# EAGLE design proiect (EAGLE 9.6.0)
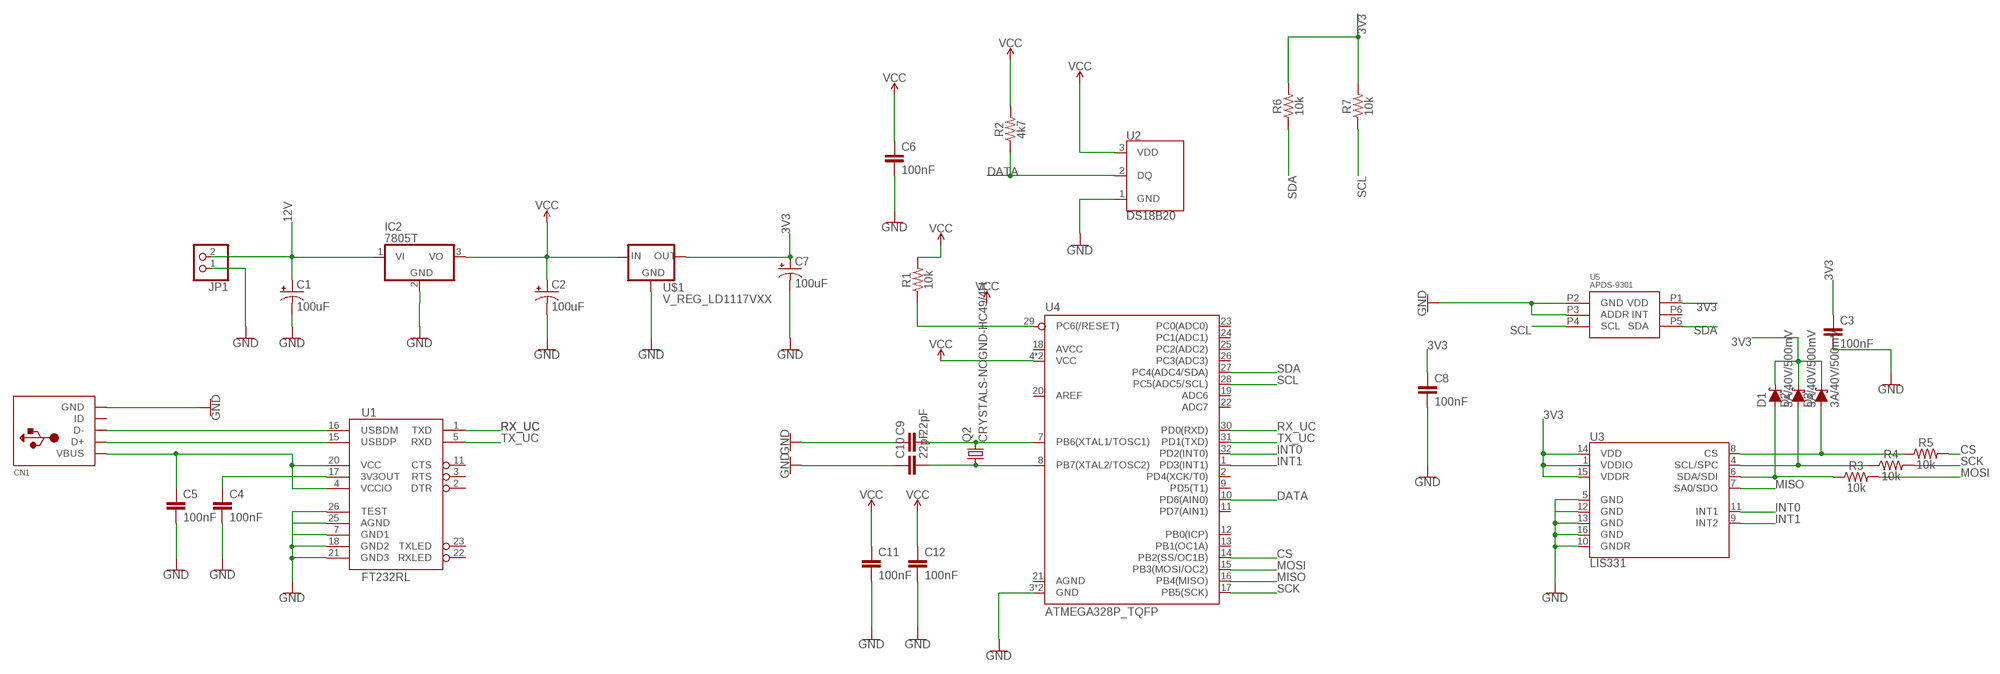
[diagram p0: schematic, sheet 1]

## Parts
C1  100uF  100UF-POLAR-RADIAL-2.5MM-25V-20%  [CPOL-RADIAL-2.5MM-6.5MM]
C2  100uF  100UF-POLAR-RADIAL-2.5MM-25V-20%  [CPOL-RADIAL-2.5MM-6.5MM]
C3  100nF  0.1UF-0603-25V-(+80/-20%)  [0603]
C4  100nF  0.1UF-0603-25V-(+80/-20%)  [0603]
C5  100nF  0.1UF-0603-25V-(+80/-20%)  [0603]
C6  100nF  0.1UF-0603-25V-(+80/-20%)  [0603]
C7  100uF  100UF-POLAR-RADIAL-2.5MM-25V-20%  [CPOL-RADIAL-2.5MM-6.5MM]
C8  100nF  0.1UF-0603-25V-(+80/-20%)  [0603]
C9  22pF  0.1UF-0603-25V-(+80/-20%)  [0603]
C10  22pF  0.1UF-0603-25V-(+80/-20%)  [0603]
C11  100nF  0.1UF-0603-25V-(+80/-20%)  [0603]
C12  100nF  0.1UF-0603-25V-(+80/-20%)  [0603]
CN1  USBMINIB  [USB-MINIB]
D1  3A/40V/500mV  DIODE-SCHOTTKY-B340A  [SMA-DIODE]
D2  3A/40V/500mV  DIODE-SCHOTTKY-B340A  [SMA-DIODE]
D3  3A/40V/500mV  DIODE-SCHOTTKY-B340A  [SMA-DIODE]
IC2  7805T  [TO220H]
JP1  PINHD-1X2  [1X02]
Q2  CRYSTALS-NOGND-HC49/4H  [HC49]
R1  10k  1KOHM-0603-1/10W-1%  [0603]
R2  4k7  1KOHM-0603-1/10W-1%  [0603]
R3  10k  1KOHM-0603-1/10W-1%  [0603]
R4  10k  1KOHM-0603-1/10W-1%  [0603]
R5  10k  1KOHM-0603-1/10W-1%  [0603]
R6  10k  1KOHM-0603-1/10W-1%  [0603]
R7  10k  1KOHM-0603-1/10W-1%  [0603]
U1  FT232RL  FT232RL-BASICSSOP  [SSOP28DB]
U2  DS18B20  [TO-92-AMMO]
U3  LIS331  [LGA-16-3X3]
U4  ATMEGA328P_TQFP  [TQFP32-08]
U5  APDS-9301  [CHIPLED-6]
U$1  V_REG_LD1117VXX  [78XXL]

## Nets
3V3: C3.1 C7.1(+) C8.1 D1.C D2.C D3.C R6.2 R7.2 U3.1(VDDIO) U3.14(VDD) U3.15(VDDR) U5.P1(VDD) U$1.GND(OUT)
12V: C1.1(+) IC2.1(VI) JP1.2
CS: R5.2 U4.14(PB2(SS/OC1B))
DATA: R2.1 U2.2(DQ) U4.10(PD6(AIN0))
GND: C1.2(-) C2.2(-) C3.2 C4.2 C5.2 C6.2 C7.2(-) C8.2 C9.1 C10.1 C11.2 C12.2 CN1.GND IC2.2(GND) JP1.1 U1.7(GND1) U1.18(GND2) U1.21(GND3) U1.25(AGND) U1.26(TEST) U2.1(GND) U3.5(GND) U3.10(GNDR) U3.12(GND) U3.13(GND) U3.16(GND) U4.3(GND) U4.5(GND) U5.P2(GND) U5.P3(ADDR) U$1.IN(GND)
INT0: U3.11(INT1) U4.32(PD2(INT0))
INT1: U3.9(INT2) U4.1(PD3(INT1))
MISO: U3.7(SA0/SDO) U4.16(PB4(MISO))
MOSI: R3.2 U4.15(PB3(MOSI/OC2))
N$1: CN1.D- U1.16(USBDM)
N$2: CN1.D+ U1.15(USBDP)
N$3: C5.1 CN1.VBUS U1.4(VCCIO) U1.20(VCC)
N$4: C4.1 U1.17(3V3OUT)
N$8: C9.2 Q2.2 U4.7(PB6(XTAL1/TOSC1))
N$9: C10.2 Q2.1 U4.8(PB7(XTAL2/TOSC2))
N$10: R1.1 U4.29(PC6(/RESET))
N$27: D1.A R3.1 U3.6(SDA/SDI)
N$28: D2.A R4.1 U3.4(SCL/SPC)
N$29: D3.A R5.1 U3.8(CS)
RX_UC: U1.1(TXD) U4.30(PD0(RXD))
SCK: R4.2 U4.17(PB5(SCK))
SCL: R7.1 U4.28(PC5(ADC5/SCL)) U5.P4(SCL)
SDA: R6.1 U4.27(PC4(ADC4/SDA)) U5.P5(SDA)
TX_UC: U1.5(RXD) U4.31(PD1(TXD))
VCC: C2.1(+) C6.1 C11.1 C12.1 IC2.3(VO) R1.2 R2.2 U2.3(VDD) U4.4(VCC) U4.6(VCC) U$1.OUT(IN)
Unconnected: CN1.ID U1.2(DTR) U1.3(RTS) U1.11(CTS) U1.22(RXLED) U1.23(TXLED) U4.2(PD4(XCK/T0)) U4.9(PD5(T1)) U4.11(PD7(AIN1)) U4.12(PB0(ICP)) U4.13(PB1(OC1A)) U4.18(AVCC) U4.19(ADC6) U4.20(AREF) U4.21(AGND) U4.22(ADC7) U4.23(PC0(ADC0)) U4.24(PC1(ADC1)) U4.25(PC2(ADC2)) U4.26(PC3(ADC3)) U5.P6(INT)

## Library data of the parts
C1 C2 C7 = SparkFun-Capacitors:100UF-POLAR: 100µF polarized capacitors A capacitor is a passive two-terminal electrical component used to store electrical energy temporarily in an electric field.; PROD_ID: CAP-08439
C3-C6 C8-C12 = SparkFun-Capacitors:0.1UF: 0.1µF ceramic capacitors A capacitor is a passive two-terminal electrical component used to store electrical energy temporarily in an electric field.; PROD_ID: CAP-00810; VALUE: 0.1uF
CN1 = adafruit:USB: USB Connectors USBMINIB - Surface Mount Female Mini-B USB Connector 4UConnector: 06564 By microbuilder.eu Thru-hole RA Female Mini-B USB Connector 4UConnector: 18732 By ladyada.net
D1-D3 = SparkFun-DiscreteSemi:DIODE-SCHOTTKY: Schottky diode A Schottky diode is a semiconductor diode which has a low forward voltage drop and a very fast switching action.; PROD_ID: DIO-09886
IC2 = adafruit:78*: Positive VOLTAGE REGULATOR Added bigger pads to the TO-92 package
JP1 = pinhead:PINHD-1X2: PIN HEADER
Q2 = IQD-Frequency-Products:CRYSTALS-NOGND: CRYSTALS CAN NOT GROUNDED
R1-R7 = SparkFun-Resistors:1KOHM: 1kΩ resistor A resistor is a passive two-terminal electrical component that implements electrical resistance as a circuit element. Resistors act to reduce current flow, and, at the same time, act to lower voltage levels within circuits. - Wikipedia; PROD_ID: RES-07856; VALUE: 1k
U1 = SparkFun-IC-Comms:FT232RL-BASIC: FT232RL USB UART This is the simplified version of the FT232RL unit. Only what you need, nothing you don't. FT232RL 4th Generation USB UART (USB <-> Serial) Controller. Datasheet <http://www.sparkfun.com/datasheets/IC/FT232R_v104.pdf> SparkFun Products Component <https://www.sparkfun.com/products/650> (COM-00650) SparkFun RedBot Mainboard <https://www.sparkfun.com/products/12097> (ROB-12097) SparkFun FTDI Basic Breakout - 5V <https://www.sparkfun.com/products/9716> (DEV-09716) SparkFun FTDI Basic Breakout - 3.3V <https://www.sparkfun.com/products/9873> (DEV-09873) Bus Pirate - v3.6a <https://www.sparkfun.com/products/12942> (TOL-12942) SparkFun USB to Serial Breakout - FT232RL <https://www.sparkfun.com/products/12731> (BOB-12731) SparkFun PicoBoard <https://www.sparkfun.com/products/11888> (WIG-11888) SparkFun RFID USB Reader <https://www.sparkfun.com/products/9963> (SEN-09963) LilyPad FTDI Basic Breakout - 5V <https://www.sparkfun.com/products/10275> (DEV-10275) SparkFun Stepoko <https://www.sparkfun.com/products/13899> (ROB-13899); PROD_ID: IC-00870
U2 = SparkFun-Sensors:DS18B20: Dallas/Maxim DS18B20 1-Wire Temperature Sensor The DS18B20 reports degrees C with 9 to 12-bit precision, -55C to 125C (+/-0.5C). Each sensor has a unique 64-Bit Serial number etched into it - allows for a huge number of sensors to be used on one data bus. Datasheet <http://datasheets.maximintegrated.com/en/ds/DS18B20.pdf> SparkFun Products One Wire Digital Temperature Sensor - DS18B20 <https://www.sparkfun.com/products/245> (SEN-00245); STORE_ID: SEN-00245
U3 = SparkFun-Sensors:LIS331: ST Microelectronics LIS331 3-Axis ±6/12/24g SPI/I2C Accelerometer The LIS331HH is an ultra low-power full-scale three axis MEMS linear accelerometer. It has a digital I2C/SPI serial interface which makes it ideal for using in embedded applications. The device also features ultra low-power operational modes that allow advanced power saving and smart sleep to wake-up functions. Datasheet <http://www.sparkfun.com/datasheets/Sensors/Accelerometer/LIS331HH.pdf> SparkFun Products SparkFun Triple Axis Accelerometer Breakout - LIS331 <https://www.sparkfun.com/products/10345> (SEN-10345) Triple Axis Accelerometer - LIS331HH <https://www.sparkfun.com/products/9755> (SEN-09755); PROD_ID: IC-12675; SF_ID: COM-09755
U4 = SparkFun-IC-Microcontroller:ATMEGA328P_TQFP: Popular 328P in QFP Storefront component: ATmega328 - TQFP <https://www.sparkfun.com/products/13448> (COM-13448) Datasheet <http://www.sparkfun.com/datasheets/Components/SMD/ATMega328.pdf> SparkFun Products SparkFun RedBoard - Programmed with Arduino <https://www.sparkfun.com/products/12757> (DEV-12757) Arduino Pro Mini 328 - 5V/16MHz <https://www.sparkfun.com/products/11113> (DEV-11113) Arduino Pro Mini 328 - 3.3V/8MHz <https://www.sparkfun.com/products/11114> (DEV-11114) SparkFun OpenLog <https://www.sparkfun.com/products/13712> (DEV-13712) SparkFun MicroView - OLED Arduino Module <https://www.sparkfun.com/products/12923> (DEV-12923) SparkFun Digital Sandbox <https://www.sparkfun.com/products/12651> (DEV-12651) SparkFun PicoBoard <https://www.sparkfun.com/products/11888> (WIG-11888) Arduino Fio <https://www.sparkfun.com/products/10116> (DEV-10116) LilyPad Arduino 328 Main Board <https://www.sparkfun.com/products/13342> (DEV-13342) SparkFun RedStick <https://www.sparkfun.com/products/13741> (DEV-13741) LilyPad MP3 <https://www.sparkfun.com/products/11013> (DEV-11013) LilyPad Arduino SimpleSnap <https://www.sparkfun.com/products/10941> (DEV-10941) SparkFun Stepoko <https://www.sparkfun.com/products/13899> (ROB-13899) SparkFun Geiger Counter <https://www.sparkfun.com/products/11345> (SEN-11345) SparkFun EL Sequencer <https://www.sparkfun.com/products/12781> (COM-12781) Arduino Pro 328 - 5V/16MHz <https://www.sparkfun.com/products/10915> (DEV-10915) CryptoCape <https://www.sparkfun.com/products/12773> (DEV-12773) SparkFun IR Thermometer Evaluation Board - MLX90614 <https://www.sparkfun.com/products/10740> (SEN-10740) SparkFun RedBot Mainboard <https://www.sparkfun.com/products/12097> (ROB-12097) Arduino Pro 328 - 3.3V/8MHz <https://www.sparkfun.com/products/10914> (DEV-10914) SparkFun Block for Intel® Edison - Arduino <https://www.sparkfun.com/products/13036> (DEV-13036) SparkFun Simon Says - Surface Mount Soldering Kit <https://www.sparkfun.com/products/10935> (KIT-10935) SparkFun 7-Segment Serial Display - Red <https://www.sparkfun.com/products/11441> (COM-11441) SparkFun 7-Segment Serial Display - White <https://www.sparkfun.com/products/11629> (COM-11629) SparkFun 7-Segment Serial Display - Yellow <https://www.sparkfun.com/products/11443> (COM-11443) SparkFun 7-Segment Serial Display - Kelly Green <https://www.sparkfun.com/products/11440> (COM-11440) SparkFun 7-Segment Serial Display - Blue <https://www.sparkfun.com/products/11442> (COM-11442) SparkFun OpenSegment Serial Display - 20mm (Blue) <https://www.sparkfun.com/products/11647> (COM-11647) SparkFun OpenSegment Serial Display - 20mm (Green) <https://www.sparkfun.com/products/11646> (COM-11646) SparkFun OpenSegment Serial Display - 20mm (White) <https://www.sparkfun.com/products/11648> (COM-11648) SparkFun OpenSegment Serial Display - 20mm (Red) <https://www.sparkfun.com/products/11644> (COM-11644) SparkFun OpenSegment Serial Display - 20mm (Yellow) <https://www.sparkfun.com/products/11645> (COM-11645) SparkFun OpenSegment Shield <https://www.sparkfun.com/products/13190> (DEV-13190); PROD_ID: IC-09069
U5 = SparkFun-Sensors:APDS-9301; PROD_ID: IC-13662
U$1 = SparkFun-IC-Power:V_REG_LD1117VXX: LD1117VXX voltage regulator. We carry the 3.3V version (COM-00526) in TO-220 package.

## Board
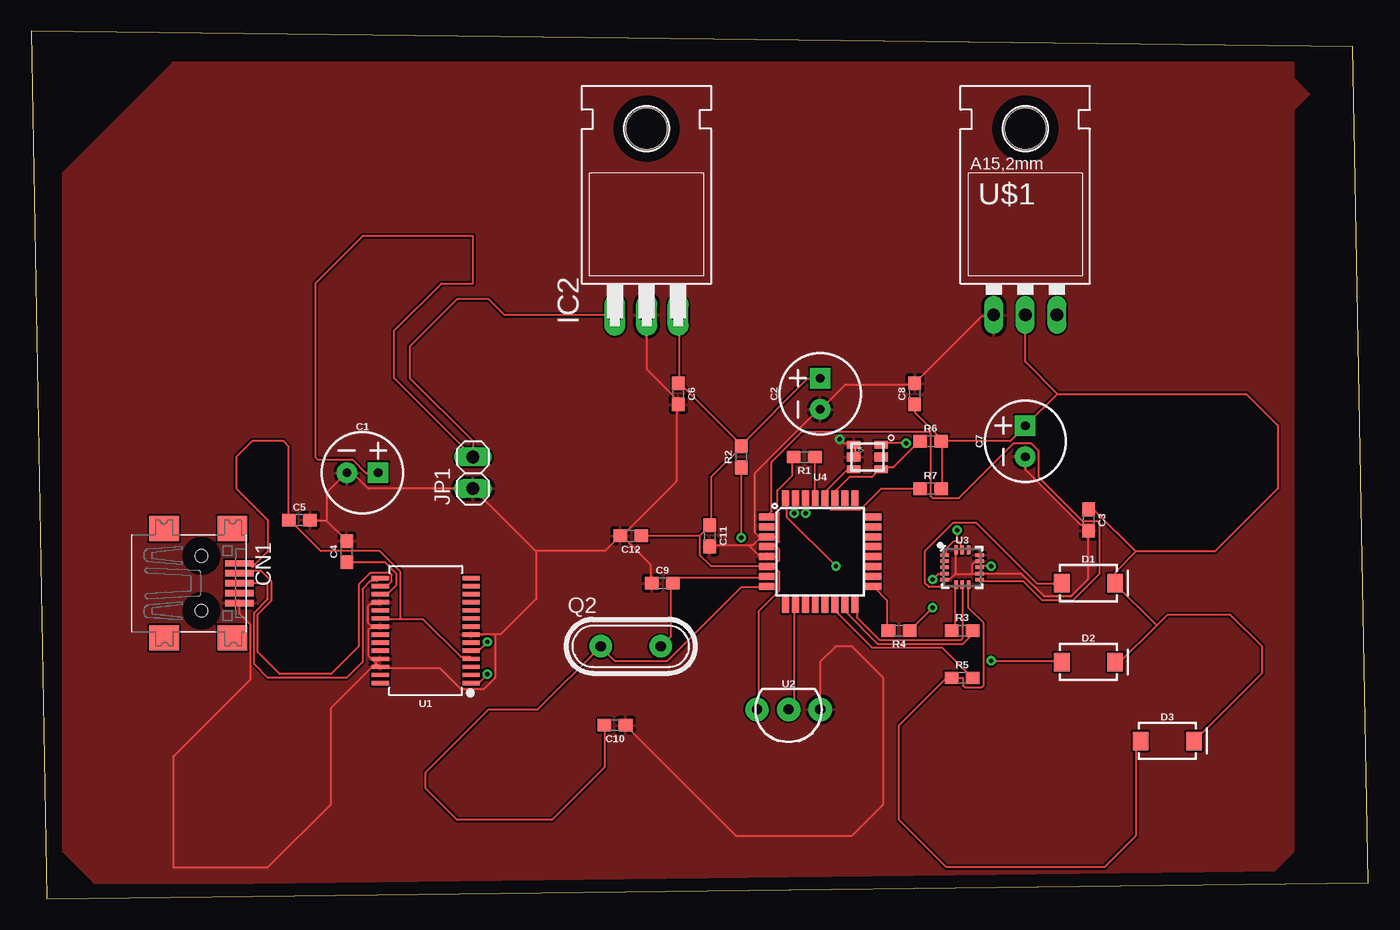
[diagram p1: board, top side]
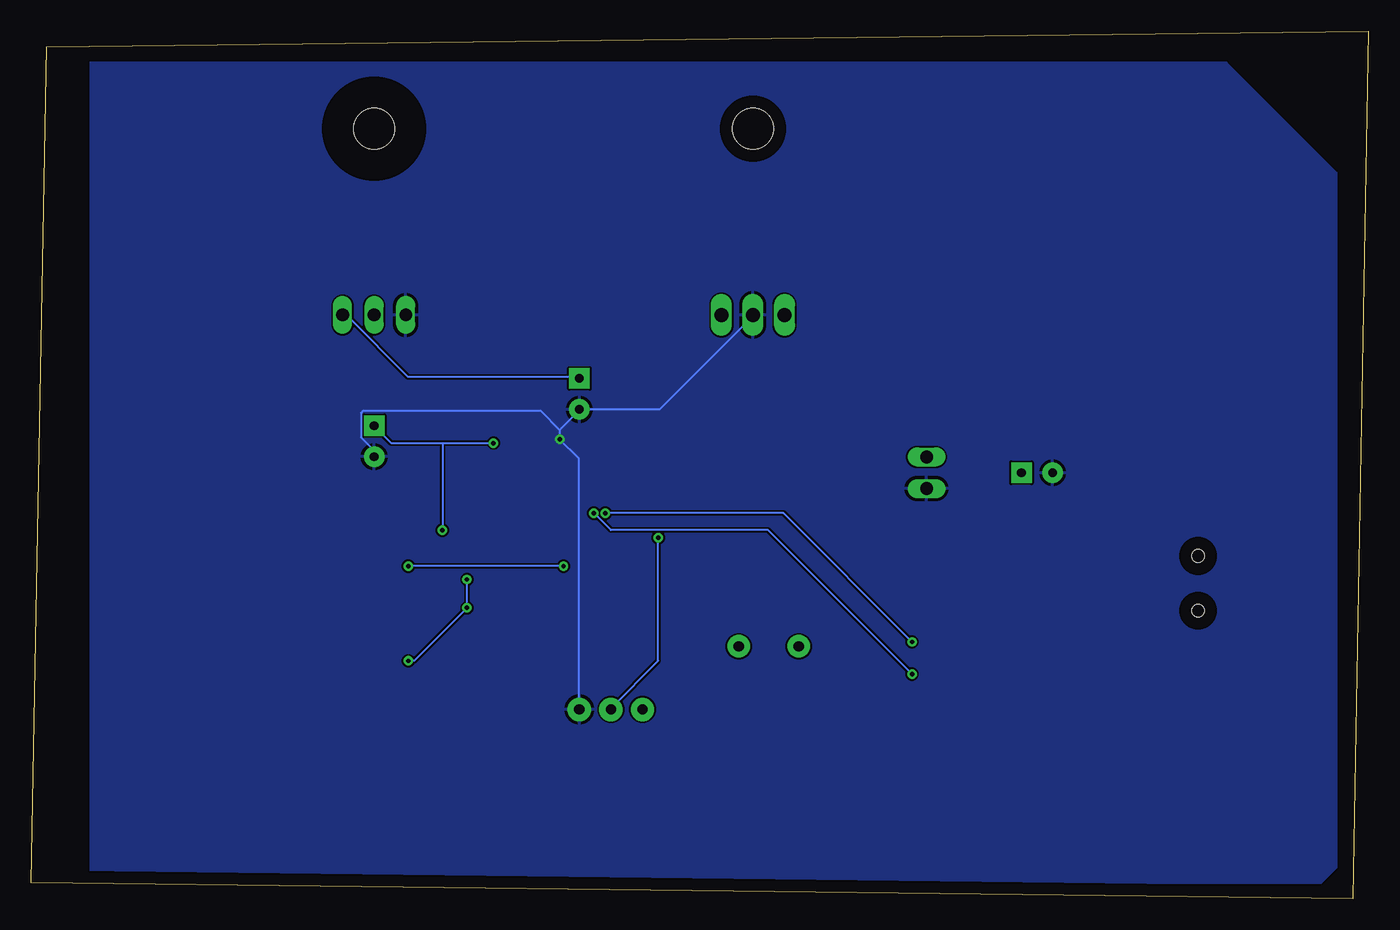
[diagram p2: board, bottom side, seen from below]

Size 107.62 x 69.84 mm. Coordinates in mm from the lower left corner, seen from the top.
Outline: 1.27,0 107.62,1.27 106.35,68.57 0,69.84 1.27,0
Copper layers (1*16): Top 0.035mm / dielectric 1.5mm / Bottom 0.035mm
Design rules "default": minimum track width 6mil, minimum drill 0.35mm, track to track 6mil, track to pad 6mil, pad to pad 6mil, via to via 6mil, smd to smd 6mil, copper to edge 40mil, drill to drill 6mil, minimum pad ring 10mil, minimum via ring 8mil, stop-mask expansion 4mil, vias tented up to drill 0mil, thermal gap 10mil

### Footprints (pad centres in the part's own frame; a part is rotated, then mirrored left to right if it is on the bottom)
CPOL-RADIAL-2.5MM-6.5MM = drill 0.7 pad 1.651 square: 1 1.25,0 | drill 0.7 pad 1.651: 2 -1.25,0
0603 = smd 1.1 x 1: 1 -0.85,0; 2 0.85,0
USB-MINIB = smd 0.5 x 2.308: D+ 0,4.064; D- -0.8,4.064; GND 1.6,4.064; ID 0.8,4.064; VBUS -1.6,4.064 | smd 2 x 2.4: GND1 -4.4,-2; GND2 -4.4,3.5; GND3 4.4,3.5; GND4 4.4,-2 | hole 1: -2.2,1; 2.2,1
SMA-DIODE = smd 1.27 x 1.47: A -2.15,0; C 2.15,0
TO220H = drill 1.118 long: 1 -2.54,-10.16; 2 0,-10.16; 3 2.54,-10.16 | hole 3.302: 0,4.826
1X02 = drill 1.016 long: 1 -1.27,0; 2 1.27,0
HC49 = drill 0.813 pad 1.8: 1 -2.413,0; 2 2.413,0
SSOP28DB = smd 0.348 x 1.397: 1 -4.225,-3.656; 2 -3.575,-3.656; 3 -2.925,-3.656; 4 -2.275,-3.656; 5 -1.625,-3.656; 6 -0.975,-3.656; 7 -0.325,-3.656; 8 0.325,-3.656; 9 0.975,-3.656; 10 1.625,-3.656; 11 2.275,-3.656; 12 2.925,-3.656; 13 3.575,-3.656; 14 4.225,-3.656; 15 4.225,3.656; 16 3.575,3.656; 17 2.925,3.656; 18 2.275,3.656; 19 1.625,3.656; 20 0.975,3.656; 21 0.325,3.656; 22 -0.325,3.656; 23 -0.975,3.656; 24 -1.625,3.656; 25 -2.275,3.656; 26 -2.925,3.656; 27 -3.575,3.656; 28 -4.225,3.656
TO-92-AMMO = drill 0.813 pad 1.88: 1 -2.54,0; 2 0,0; 3 2.54,0
LGA-16-3X3 = smd 0.7 x 0.28: 1 -1.4,1; 2 -1.4,0.5; 3 -1.4,0; 4 -1.4,-0.5; 5 -1.4,-1; 9 1.4,-1; 10 1.4,-0.5; 11 1.4,0; 12 1.4,0.5; 13 1.4,1 | smd 0.28 x 0.7: 6 -0.5,-1.4; 7 0,-1.4; 8 0.5,-1.4; 14 0.5,1.4; 15 0,1.4; 16 -0.5,1.4
TQFP32-08 = smd 1.27 x 0.559: 1 -4.293,2.8; 2 -4.293,2; 3 -4.293,1.2; 4 -4.293,0.4; 5 -4.293,-0.4; 6 -4.293,-1.2; 7 -4.293,-2; 8 -4.293,-2.8; 17 4.293,-2.8; 18 4.293,-2; 19 4.293,-1.2; 20 4.293,-0.4; 21 4.293,0.4; 22 4.293,1.2; 23 4.293,2; 24 4.293,2.8 | smd 0.559 x 1.27: 9 -2.8,-4.293; 10 -2,-4.293; 11 -1.2,-4.293; 12 -0.4,-4.293; 13 0.4,-4.293; 14 1.2,-4.293; 15 2,-4.293; 16 2.8,-4.293; 25 2.8,4.293; 26 2,4.293; 27 1.2,4.293; 28 0.4,4.293; 29 -0.4,4.293; 30 -1.2,4.293; 31 -2,4.293; 32 -2.8,4.293
CHIPLED-6 = smd 1.1 x 0.6: P1 1.1,1; P2 -1.1,1; P4 -1.1,-1; P5 1.1,-1 | smd 1.1 x 0.7: P3 -1.1,0; P6 1.1,0
78XXL = drill 1.016 long: GND 0,-3.81; IN -2.54,-3.81; OUT 2.54,-3.81 | hole 3.302: 0,11.176

### Placement (x,y rotation side)
C1  26.67,34.29 0 top
C2  63.5,40.64 90 top
C3  85.09,30.48 270 top
C4  25.4,27.94 90 top
C5  21.59,30.48 0 top
C6  52.07,40.64 270 top
C7  80.01,36.83 90 top
C8  71.12,40.64 90 top
C9  50.8,25.4 0 top
C10  46.99,13.97 180 top
C11  54.61,29.21 270 top
C12  48.26,29.21 180 top
CN1  12.7,25.4 270 top
D1  85.09,25.4 0 top
D2  85.09,19.05 0 top
D3  91.44,12.7 0 top
IC2  49.53,57.15 0 top
JP1  35.56,34.29 90 top
Q2  48.26,20.32 0 top
R1  62.23,35.56 180 top
R2  57.15,35.56 90 top
R3  74.93,21.59 0 top
R4  69.85,21.59 180 top
R5  74.93,17.78 0 top
R6  72.39,36.83 0 top
R7  72.39,33.02 0 top
U1  31.75,21.59 90 top
U2  60.96,15.24 180 top
U3  74.93,26.67 0 top
U4  63.5,27.94 0 top
U5  67.31,35.56 0 top
U$1  80.01,50.8 0 top

### Tracks (layer width: path | path; a pad name or v marks a point on that pad's centre or on a via)
3V3  (via drill 0.35)
  Top 0.152: 82.6,40.64 82.57,40.64 C7.1 80.01,38.05 78.79,36.83 73.3,36.83 | 82.6,40.64 97.79,40.64 100.33,38.1 100.33,33.02 95.25,27.94 88.9,27.94 | 88.9,27.94 87.24,26.28 D1.C 87.17,25.4 90.58,22 | D3.C 99.06,18.17 99.06,20.32 96.52,22.86 91.44,22.86 90.58,22 | 90.58,22 87.63,19.05 D2.C | 73.3,36.83 73.3,33.02 R7.2 | C8.1 71.17,39.73 71.17,39.12 73.15,37.14 73.15,36.83 R6.2 73.3,36.83 | 74.52,28.75 74.68,28.75 74.83,28.6 74.83,28.14 U3.15 74.98,28.14 75.44,28.14 U3.14 | 74.52,28.75 74.22,28.75 73.61,28.14 73.61,27.69 U3.1 | v70.41,36.68 68.43,36.68 U5.P1 | 88.9,27.94 85.65,31.19 85.19,31.19 C3.1 | v74.52,29.67 74.52,28.75 | U$1.GND 80.01,43.23 82.6,40.64
  Bottom 0.152: 74.52,36.68 78.64,36.68 80.01,38.05 C7.1 | 74.52,36.68 v70.41,36.68 | 74.52,36.68 v74.52,29.67
12V
  Top 0.152: IC2.1 38.1,46.99 36.83,48.26 34.29,48.26 30.48,44.45 30.48,41.91 35.56,36.83 JP1.2 29.21,41.91 29.21,45.72 33.02,49.53 35.56,49.53 35.56,53.34 26.67,53.34 22.86,49.53 22.86,35.56 23.08,35.34 25.86,35.34 26.91,34.29 C1.1
CS
  Top 0.152: R5.2 75.74,17.78 73.3,20.22 67.67,20.22 64.77,23.11 64.77,23.57 U4.14
DATA  (via drill 0.35)
  Top 0.152: v57.15,29.06 R2.1 | U4.10 61.42,23.57 61.42,15.8 60.96,15.34 U2.2
  Bottom 0.152: v57.15,29.06 57.15,19.15 60.96,15.34 U2.2
GND  (via drill 0.35)
  Top 0.152: 40.64,27.94 JP1.1 27.13,33.02 25.91,34.24 25.45,34.24 C1.2 25.3,34.24 23.77,32.72 23.77,30.43 | 40.64,27.94 40.64,24.13 37.8,21.29 37.34,21.29 | C10.1 56.73,5.08 66.04,5.08 68.58,7.62 68.58,17.78 66.04,20.32 64.77,20.32 63.5,19.05 U2.1 | CN1.GND 16.76,22.96 17.63,22.1 17.63,17.63 11.43,11.43 11.43,2.54 19.05,2.54 24.13,7.62 24.13,15.35 27.76,18.98 | 27.76,18.98 U1.25 | IC2.2 49.53,42.62 51.97,40.18 51.97,39.88 C6.2 51.97,39.73 51.97,33.63 47.55,29.21 | 23.77,30.43 22.55,30.43 C5.2 | 23.77,30.43 25.3,28.9 C4.2 | 27.76,18.98 28.04,18.69 U1.26 28.19,18.54 32.92,18.54 34.59,16.87 36.42,16.87 37.34,17.78 37.34,21.29 | 27.43,21.89 27.13,21.59 27.13,19.61 27.74,19 27.76,18.98 | 27.43,21.89 28.04,21.89 U1.21 27.43,21.89 | 27.43,21.89 27.13,22.2 27.13,23.57 27.28,23.72 28.04,23.72 U1.18 | 37.34,21.29 35.51,21.29 U1.7 | 47.55,29.21 49.84,26.92 49.84,25.4 C9.1 | 40.64,27.94 40.69,27.99 46.18,27.99 47.4,29.21 C12.2 47.55,29.21 | U3.13 76.35,27.53 76.35,27.23 U3.12 76.2,27.08 75.89,27.08 75.74,26.92 75.74,26.16 | 74.37,26.16 73.91,25.71 73.61,25.71 U3.5 | 74.37,26.16 74.37,27.99 U3.16 | 74.37,26.16 75.74,26.16 | 75.74,26.16 76.2,26.16 U3.10 76.35,26.16 79.7,26.16 81.53,24.33 83.67,24.33 85.04,25.71 85.04,29.52 C3.2 85.04,29.67 84.58,30.12 84.43,30.12 80.01,34.54 C7.2 | 57.76,28.45 58.06,28.45 58.67,29.06 | 57.76,28.45 54.71,28.45 C11.2 | 58.67,29.06 59.13,29.06 U4.3 58.67,29.06 | 57.76,28.45 58.52,27.69 59.13,27.69 U4.5 | U5.P3 66.29,35.61 66.29,36.53 U5.P2 66.14,36.68 65.38,36.68 v65.08,36.98 | U$1.IN 77.42,46.89 76.5,46.89 71.17,41.55 C8.2 71.02,41.4 65.53,41.4 63.55,39.42 C2.2 63.4,39.42 58.22,34.24 58.22,29.52 58.67,29.06
  Bottom 0.152: 65.08,37.74 v65.08,36.98 63.55,35.46 63.55,15.34 U2.1 | 65.08,37.74 63.55,39.27 C2.2 63.4,39.42 57,39.42 49.53,46.89 IC2.2 | C7.2 80.01,36.07 81.08,37.14 81.08,39.12 80.92,39.27 66.6,39.27 65.08,37.74
  pour Top: 5.08,1.27 99.06,1.27 101.6,3.81 101.6,63.5 102.87,64.77 101.6,66.04 101.6,67.31 11.43,67.31 2.54,58.42 2.54,45.72 2.54,3.81
  pour Bottom: 12.7,67.31 102.87,67.31 102.87,1.27 3.81,1.27 2.54,2.54 2.54,6.35 2.54,58.42 11.43,67.31
INT0  (via drill 0.35)
  Top 0.152: v77.27,26.77 76.35,26.77 U3.11 | v64.77,26.77 60.81,30.73 60.81,32.11 U4.32
  Bottom 0.152: v64.77,26.77 v77.27,26.77
INT1
  Top 0.152: U3.9 76.35,25.55 79.86,25.55 81.38,24.03 83.82,24.03 85.95,26.16 85.95,30.28 85.8,30.43 84.58,30.43 81.08,33.93 81.08,36.07 80.47,36.68 79.1,36.68 74.68,32.26 72.54,32.26 72.39,32.41 72.39,37.44 72.24,37.59 62.03,37.59 59.59,35.15 59.59,31.19 59.28,30.89 U4.1
MISO
  Top 0.152: U3.7 74.98,25.25 74.98,20.98 74.83,20.83 68.28,20.83 66.45,22.66 66.45,23.57 U4.16
MOSI
  Top 0.152: R3.2 75.74,21.59 75.74,21.29 74.98,20.52 68.12,20.52 65.53,23.11 65.53,23.57 U4.15
N$1
  Top 0.152: U1.16 28.64,25.17 29.02,25.55 29.02,26.08 28.89,26.22 27.3,26.22 26.36,25.28 26.36,20.32 24.13,18.09 20.02,18.09 18.24,19.86 18.24,22.89 19.36,24 19.36,25.53 18.51,26.37 16.94,26.37 CN1.D-
N$2
  Top 0.152: U1.15 27.85,25.57 27.3,25.57 26.67,24.94 26.67,19.05 25.4,17.78 19.05,17.78 17.93,18.9 17.93,23.01 19.05,24.13 19.05,25.4 17.83,25.4 17.78,25.4 CN1.D+
N$3
  Top 0.152: 18.01,26.9 19.05,27.94 19.05,30.48 16.51,33.02 16.51,35.56 17.78,36.83 20.32,36.83 20.74,36.41 C5.1 20.88,30.43 23.32,27.99 28.04,27.99 29.72,26.31 29.72,22.5 | 18.01,26.9 17.79,26.68 17.78,26.68 | CN1.VBUS 16.76,26.92 17.98,26.92 18.01,26.9 | 29.72,22.5 31.55,22.5 34.59,19.46 35.36,19.46 U1.4 | 29.72,22.5 28.19,22.5 U1.20
N$4
  Top 0.152: C4.1 25.45,27.08 28.5,27.08 29.41,26.16 29.41,25.25 28.8,24.64 28.19,24.64 U1.17
N$8
  Top 0.152: Q2.2 50.75,20.37 51.51,21.13 51.51,25.4 C9.2 51.66,25.4 52.12,25.86 59.13,25.86 U4.7
N$9
  Top 0.152: C10.2 46.14,10.58 41.91,6.35 34.29,6.35 31.75,8.89 31.75,10.16 36.83,15.24 40.77,15.24 Q2.1 45.87,20.22 46.94,19.15 51.21,19.15 57.15,25.1 59.13,25.1 U4.8
N$10
  Top 0.152: R1.1 63.09,35.46 63.09,32.26 U4.29
N$27
  Top 0.152: 74.37,25.1 74.37,21.74 74.22,21.59 R3.1 | 74.37,25.1 74.37,25.25 U3.6 74.37,25.1 | D1.A 80.92,25.4 76.05,30.28 74.22,30.28 71.93,27.99 71.93,25.4 72.24,25.1 74.37,25.1
N$28  (via drill 0.35)
  Top 0.152: v72.54,25.71 73,26.16 73.46,26.16 U3.4 | v72.54,23.42 70.71,21.59 R4.1 | v77.27,19.15 82.91,19.15 D2.A
  Bottom 0.152: v72.54,25.71 v72.54,23.42 76.81,19.15 v77.27,19.15
N$29
  Top 0.152: D3.A 88.9,12.31 88.9,5.08 86.36,2.54 73.66,2.54 69.85,6.35 69.85,13.97 73.66,17.78 74.07,17.78 R5.1 74.98,17.78 74.98,17.17 75.13,17.02 76.5,17.02 76.66,17.17 76.66,22.2 75.44,23.42 75.44,25.25 U3.8
RX_UC  (via drill 0.35)
  Top 0.152: v62.33,31.04 62.33,32.11 U4.30 | v36.73,18.09 36.12,17.48 35.51,17.48 U1.1
  Bottom 0.152: v62.33,31.04 60.96,29.67 48.31,29.67 v36.73,18.09
SCK
  Top 0.152: R4.2 68.89,21.59 68.89,24.03 67.82,25.1 U4.17
SCL
  Top 0.152: U5.P4 66.14,34.54 65.68,34.54 64.01,32.87 64.01,32.26 U4.28 64.01,32.11 64.01,31.65 64.31,31.34 66.75,31.34 68.43,33.02 R7.1
SDA
  Top 0.152: R6.1 71.48,36.83 69.34,34.7 68.43,34.7 U5.P5 68.28,34.54 67.67,33.93 65.84,33.93 64.77,32.87 64.77,32.26 U4.27
TX_UC  (via drill 0.35)
  Top 0.152: v61.42,31.04 61.42,32.11 U4.31 | v36.73,20.68 36.12,20.07 35.51,20.07 U1.5
  Bottom 0.152: v61.42,31.04 47.09,31.04 v36.73,20.68
VCC
  Top 0.152: 59.89,28.45 60.2,28.75 60.2,31.04 60.05,31.19 60.05,32.87 61.27,34.09 61.27,35.46 R1.2 | 59.89,28.45 59.28,28.45 U4.4 | 59.74,26.77 59.28,26.77 U4.6 | 59.74,26.77 60.2,27.23 60.2,28.14 59.89,28.45 | 59.74,26.77 60.2,26.31 60.2,24.79 58.52,23.11 58.52,15.34 U2.3 | 59.74,26.77 U4.6 | 53.8,29.21 C12.1 | 53.8,29.21 54.56,29.97 C11.1 54.71,30.12 54.71,33.93 57.15,36.37 R2.2 57.15,36.53 | 52.12,41.55 52.12,46.89 IC2.3 | 52.12,41.55 57.15,36.53 | 52.12,41.55 C6.1 | 53.8,29.21 53.8,27.69 54.71,26.77 59.13,26.77 U4.6 | 57.15,36.53 62.48,41.86 63.4,41.86 C2.1
  Bottom 0.152: U$1.OUT 82.45,46.89 82.14,46.89 77.27,42.01 63.55,42.01 C2.1